# Altium schematic sheet REGENIX_ESP32.SchDoc
size Tabloid; Date: Date; Author: Author 1; DocumentNumber: 3; Revision: 1; SheetNumber: 3; SheetTotal: 17; Size: 11x17; Sheet_Name: ESP32
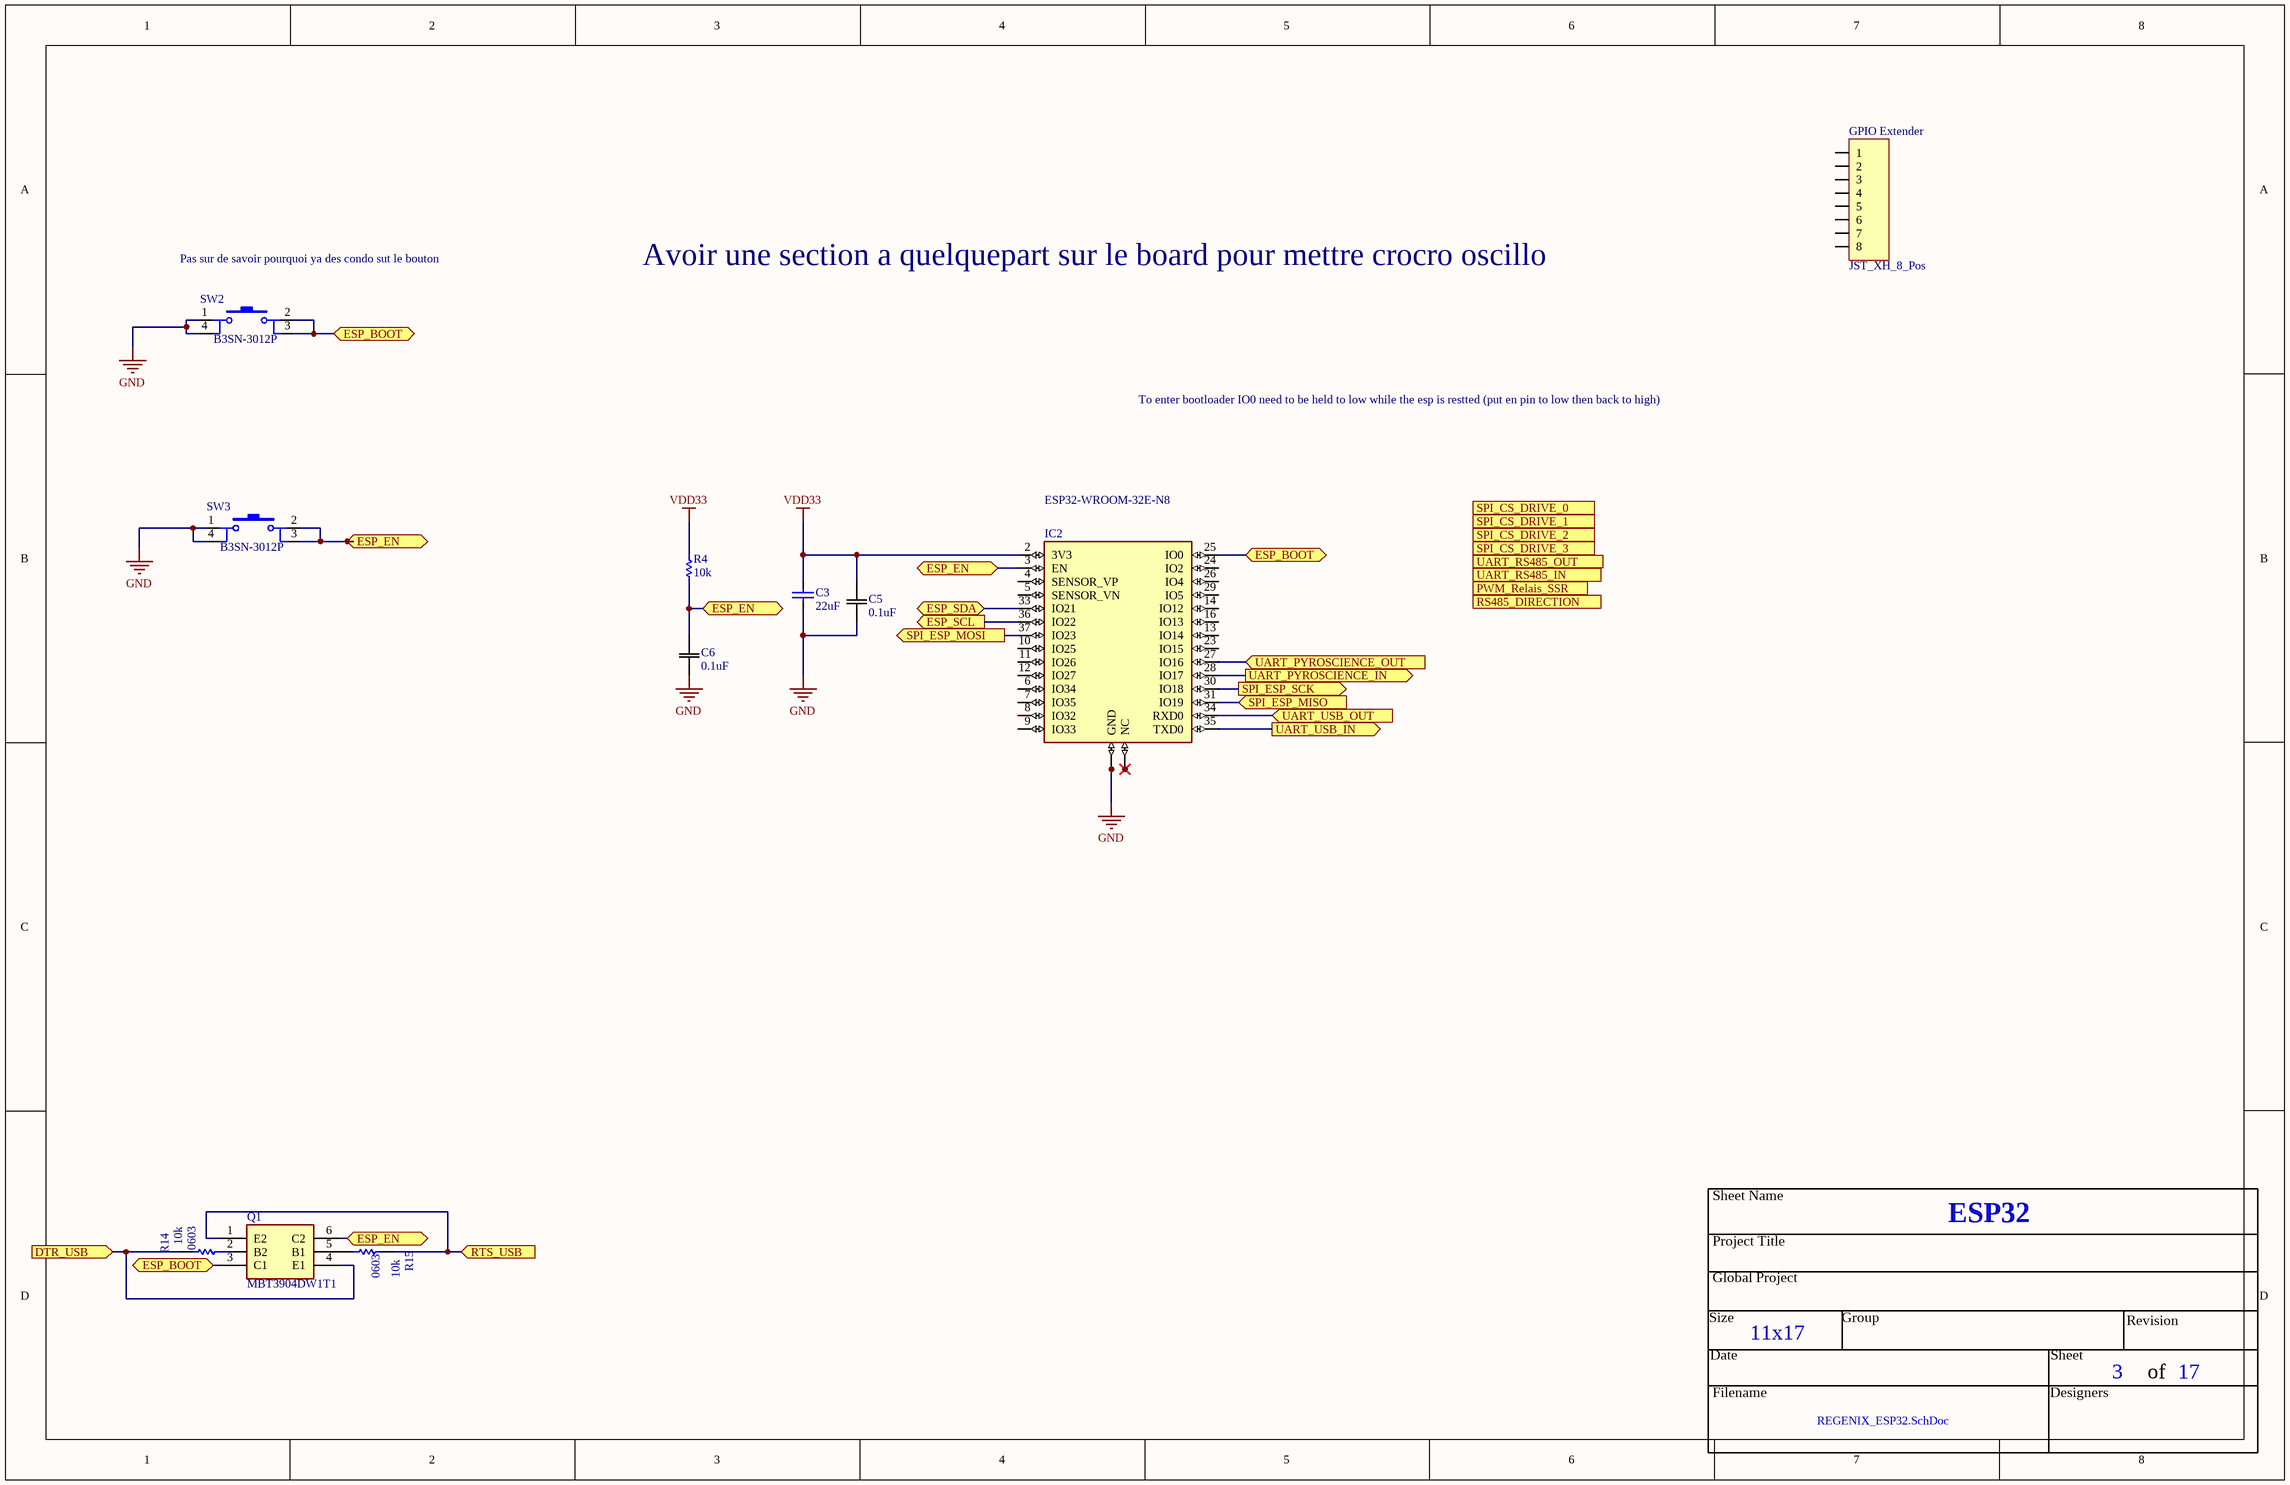
[diagram p0: REGENIX_ESP32.SchDoc]

## Parts
C3  value 22uF  [CAPACITOR-0805]  (hidden comment: Capacitor-0805-22uF-16V-X5R)
C5  0.1uF  [CAP_CL10_SAM]
C6  0.1uF  [CAP_CL10_SAM]
GPIO_Extender  JST_XH_8_Pos  [JST_XH_8_Pos]
IC2  ESP32-WROOM-32E-N8  [ESP32WROOM32EN8]
Q1  MBT3904DW1T1  [SOT65P210X110-6N]
R4  value 10k  [RESISTOR-1206]  (hidden comment: SMT resistor)
R14  value 10k  Package: 0603  [RES_0603]  (hidden comment: RES - 0603)
R15  value 10k  Package: 0603  [RES_0603]  (hidden comment: RES - 0603)
SW2  B3SN-3012P  [SWI_TACT_B3SN-3012P]
SW3  B3SN-3012P  [SWI_TACT_B3SN-3012P]

## Ports
DTR_USB (in), ESP_BOOT (bidir), ESP_EN (bidir), ESP_SCL (out), ESP_SDA (bidir), PWM_Relais_SSR (out), RS485_DIRECTION (out), RTS_USB (in), SPI_CS_DRIVE_0 (out), SPI_CS_DRIVE_1 (out), SPI_CS_DRIVE_2 (out), SPI_CS_DRIVE_3 (out), SPI_ESP_MISO (in), SPI_ESP_MOSI (out), SPI_ESP_SCK (out), UART_PYROSCIENCE_IN (out), UART_PYROSCIENCE_OUT (in), UART_RS485_IN (out), UART_RS485_OUT (in), UART_USB_IN (out), UART_USB_OUT (in)

## Nets
GND: C3.2 C5.1 C6.1 IC2.1(GND) IC2.15(GND) IC2.38(GND) IC2.39(GND) IC2.40(GND) IC2.41(GND) IC2.42(GND) IC2.43(GND) IC2.44(GND) IC2.45(GND) IC2.46(GND) IC2.47(GND) SW2.1 SW2.4 SW3.1 SW3.4
VDD33: C3.1 C5.2 IC2.2(3V3) R4.1
DTR_USB: Q1.4(E1) R14.2 ; port DTR_USB
ESP_BOOT: IC2.25(IO0) Q1.3(C1) SW2.2 SW2.3 ; port ESP_BOOT
ESP_EN: C6.2 IC2.3(EN) Q1.6(C2) R4.2 SW3.2 SW3.3 ; port ESP_EN
ESP_SCL: IC2.36(IO22) ; port ESP_SCL
ESP_SDA: IC2.33(IO21) ; port ESP_SDA
RTS_USB: Q1.1(E2) R15.2 ; port RTS_USB
SPI_ESP_MISO: IC2.31(IO19) ; port SPI_ESP_MISO
SPI_ESP_MOSI: IC2.37(IO23) ; port SPI_ESP_MOSI
SPI_ESP_SCK: IC2.30(IO18) ; port SPI_ESP_SCK
UART_PYROSCIENCE_IN: IC2.28(IO17) ; port UART_PYROSCIENCE_IN
UART_PYROSCIENCE_OUT: IC2.27(IO16) ; port UART_PYROSCIENCE_OUT
UART_USB_IN: IC2.35(TXD0) ; port UART_USB_IN
UART_USB_OUT: IC2.34(RXD0) ; port UART_USB_OUT
NetIC2_17: IC2.17(NC) IC2.18(NC) IC2.19(NC) IC2.20(NC) IC2.21(NC) IC2.22(NC) IC2.32(NC)
NetQ1_2: Q1.2(B2) R14.1
NetQ1_5: Q1.5(B1) R15.1

Not connected (* = marked no-connect by the designer): GPIO_Extender 1 2 3 4 5 6 7 8; IC2 4(SENSOR_VP) 5(SENSOR_VN) 6(IO34) 7(IO35) 8(IO32) 9(IO33) 10(IO25) 11(IO26) 12(IO27) 13(IO14) 14(IO12) 16(IO13) 23(IO15) 24(IO2) 26(IO4) 29(IO5)

## Notes on the sheet
- Pas sur de savoir pourquoi ya des condo sut le bouton
- Avoir une section a quelquepart sur le board pour mettre crocro oscillo
- To enter bootloader IO0 need to be held to low while the esp is restted (put en pin to low then back to high)
- Sheet Name
- Project Title
- Global Project
- Revision
- Size
- Date
- Group
- Sheet
- of
- Filename
- Designers

## Library data of the parts
C3 = Capacitor-0805-22uF-16V-X5R: Precision: X5R-10%; Volt: 16V; Package / Case: Metric 2012 , EIA 0805; Mounted: Yes; Supplier 1: Digi-Key; Supplier Part Number 1: 1276-6780-1-ND; Supplier 2: Digi-Key; Supplier 3: Digi-Key; Supplier 4: Digi-Key
C5 C6 = CL10B104KB8NNWC: CAP CER 0.1UF 50V X7R 0603 CL10B104KB8NNWC; Mfr_Name: Samsung
GPIO_Extender = JST_XH_8_Pos: CONN HEADER VERT 8POS 2.5MM; Supplier 1: Digi-Key; Supplier Part Number 1: 455-B8B-XH-A-ND; Mounted: Yes; Package / Case: TH; Volt: N/A; Help URL: https://www.jst-mfg.com/product/pdf/eng/eXH.pdf
IC2 = ESP32-WROOM-32E-N8: Bluetooth, WiFi 802.11b/g/n, Bluetooth v4.2 +EDR, Class 1, 2 and 3 Transceiver Module 2.4GHz ~ 2.5GHz PCB Trace Surface Mount; MF: Espressif Systems; SnapEDA_Link: https://www.snapeda.com/parts/ESP32-WROOM-32E-N8/Espressif+Systems/view-part/?ref=snap; Package: SMD-44 Espressif Systems; Value: *; MP: ESP32-WROOM-32E-N8; Check_prices: https://www.snapeda.com/parts/ESP32-WROOM-32E-N8/Espressif+Systems/view-part/?ref=eda
Q1 = MBT3904DW1T1: Transistor; Manufacturer_Name: onsemi; Datasheet Link: https://www.onsemi.com/download/data-sheet/pdf/MBT3904DW1T1-D.PDF; Height: 1.1mm; Manufacturer_Part_Number: MBT3904DW1T1; Mouser Part Number: 863-MBT3904DW1T1; Mouser Price/Stock: https://www.mouser.co.uk/ProductDetail/onsemi/MBT3904DW1T1?qs=3JMERSakebpLNkv8FfUEPQ%3D%3D
R4 = Resistor1206-10k: Precision: 1%; Watt: 0.1W; Mounted: Yes; Package / Case: Metric 3216, EIA 1206; Supplier 2: Digi-Key; Supplier 4: Digi-Key; Supplier 1: Digi-Key; Supplier 3: Digi-Key; Supplier Part Number 1: RMCF1206FT10K0TR-ND
R14 R15 = RES - 0603: Precision: 1%; Current: *; CreatedBy: Jonathan Bouchard
SW2 SW3 = SWI_TACT_B3SN-3012P: SWI - TACT SPST-NO 0.05A 24V - 4-SMD; Current: 50mA; Mfg: Omron; Mfg Part Number: B3SN-3012P; HelpURL: http://www.omron.com/ecb/products/pdf/en-b3sn.pdf; CreatedBy: Jonathan Bouchard; Temperature: -25°C ~ 70°C; Power: *; Precision: *; Package: 4-SMD; Value: *; Voltage: 24V; Supplier 1: Digikey; Supplier Part Number 1: SW261CT-ND